# Altium project 6s电池均衡.PrjPcb
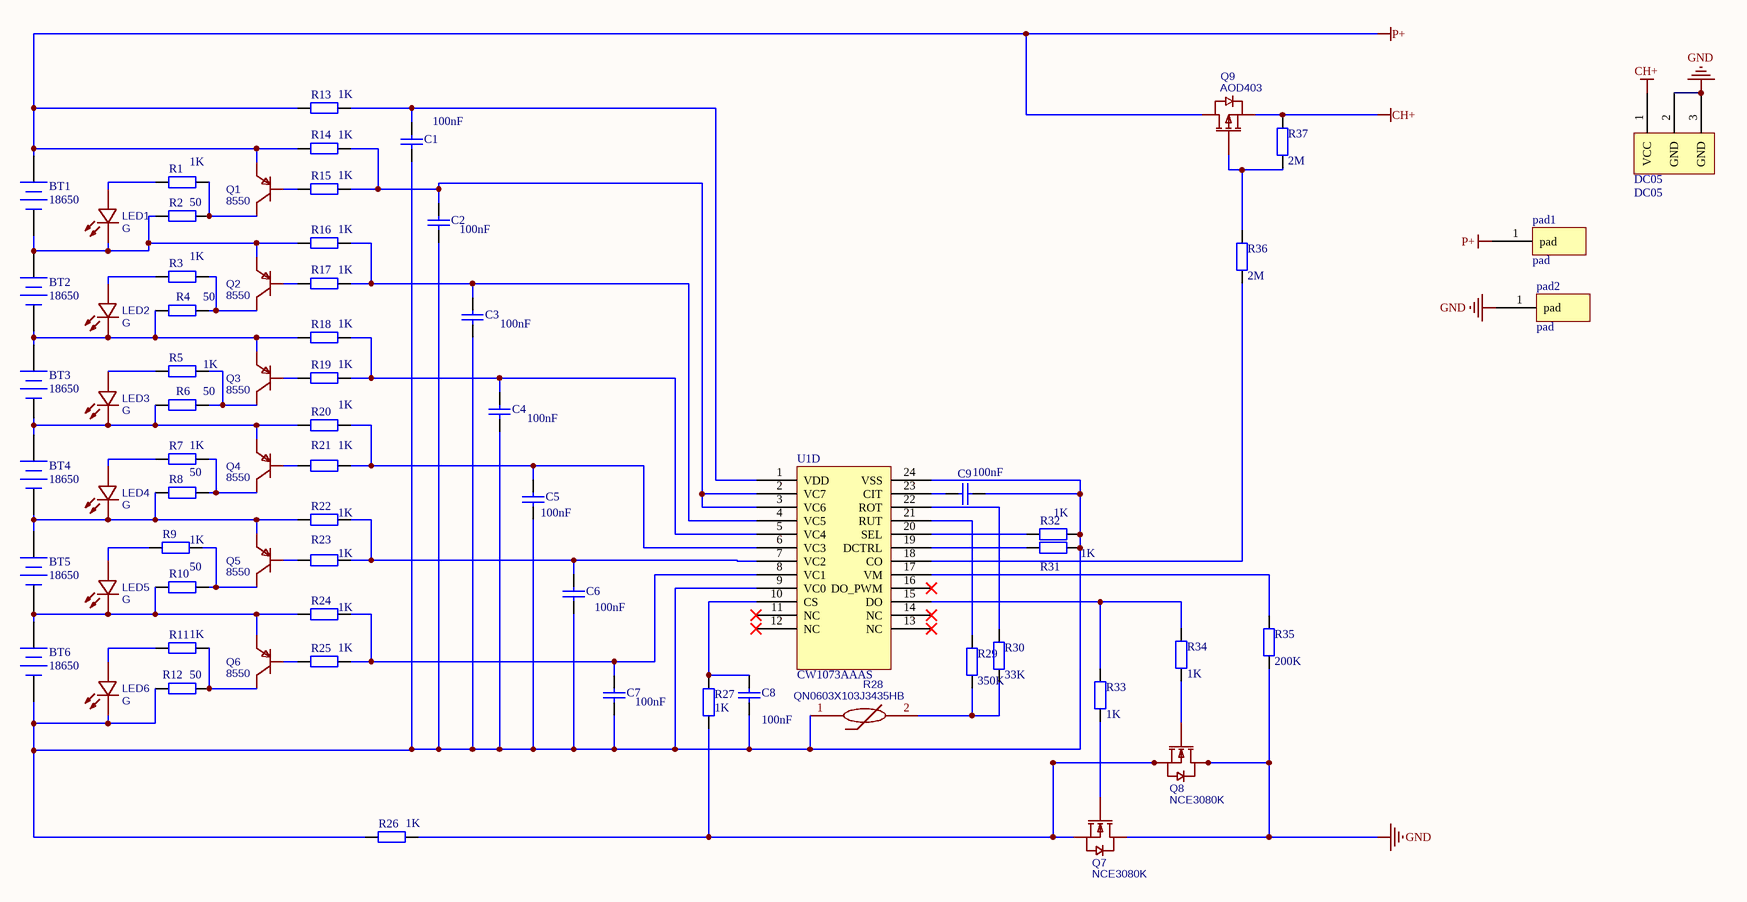
[diagram p0: Sheet1.SchDoc]
1 sheet, 71 parts. Net scope: global (net labels, ports and power ports of the same name join across sheets).
Board file: PCB3.PcbDoc

## Sheet Sheet1.SchDoc
size A3

### Parts
BT1  18650  [18650-贴片]
BT2  18650  [18650-贴片]
BT3  18650  [18650-贴片]
BT4  18650  [18650-贴片]
BT5  18650  [18650-贴片]
BT6  18650  [18650-贴片]
C1  value 100nF  [0805_C]
C2  value 100nF  [0805_C]
C3  value 100nF  [0805_C]
C4  value 100nF  [0805_C]
C5  value 100nF  [0805_C]
C6  value 100nF  [0805_C]
C7  value 100nF  [0805_C]
C8  value 100nF  [0805_C]
C9  value 100nF  [0805_C]
DC05  DC05  [DC-005 - duplicate]
LED1  G  [LED_0805]
LED2  G  [LED_0805]
LED3  G  [LED_0805]
LED4  G  [LED_0805]
LED5  G  [LED_0805]
LED6  G  [LED_0805]
pad1  pad  [PAD3*3]
pad2  pad  [PAD3*3]
Q1  8550  [SOT23]
Q2  8550  [SOT23]
Q3  8550  [SOT23]
Q4  8550  [SOT23]
Q5  8550  [SOT23]
Q6  8550  [SOT23]
Q7  NCE3080K  [LC-TO-252-2]
Q8  NCE3080K  [LC-TO-252-2]
Q9  AOD403  [LC-TO-252-2]
R1  value 1K  [0603-R]
R2  value 50  [LC-2512_R]
R3  value 1K  [0603-R]
R4  value 50  [LC-2512_R]
R5  value 1K  [0603-R]
R6  value 50  [LC-2512_R]
R7  value 1K  [0603-R]
R8  value 50  [LC-2512_R]
R9  value 1K  [0603-R]
R10  value 50  [LC-2512_R]
R11  value 1K  [0603-R]
R12  value 50  [LC-2512_R]
R13  value 1K  [0603-R]
R14  value 1K  [0603-R]
R15  value 1K  [0603-R]
R16  value 1K  [0603-R]
R17  value 1K  [0603-R]
R18  value 1K  [0603-R]
R19  value 1K  [0603-R]
R20  value 1K  [0603-R]
R21  value 1K  [0603-R]
R22  value 1K  [0603-R]
R23  value 1K  [0603-R]
R24  value 1K  [0603-R]
R25  value 1K  [0603-R]
R26  value 1K  [0603-R]
R27  value 1K  [0603-R]
R28  QN0603X103J3435HB  [0603-R]
R29  value 350K  [0603-R]
R30  value 33K  [0603-R]
R31  value 1K  [0603-R]
R32  value 1K  [0603-R]
R33  value 1K  [0603-R]
R34  value 1K  [0603-R]
R35  value 200K  [0603-R]
R36  value 2M  [0603-R]
R37  value 2M  [0603-R]
U1  CW1073AAAS  [LC-SSOP-24_208mil]  (part D of 4)

### Nets
CH+: DC05.1(VCC) Q9.3(S) R37.2
GND: DC05.2(GND) DC05.3(GND) pad2.1(pad) Q7.2(D) Q8.2(D) R35.1
P+: BT1.1(+) pad1.1(pad) Q1.2(E) Q9.2(D) R13.1 R14.1
NetBT1_2: BT1.2(-) BT2.1(+) LED1.2(K) Q2.2(E) R2.1 R16.1
NetBT2_2: BT2.2(-) BT3.1(+) LED2.2(K) Q3.2(E) R4.1 R18.1
NetBT3_2: BT3.2(-) BT4.1(+) LED3.2(K) Q4.2(E) R6.1 R20.1
NetBT4_2: BT4.2(-) BT5.1(+) LED4.2(K) Q5.2(E) R8.1 R22.1
NetBT5_2: BT5.2(-) BT6.1(+) LED5.2(K) Q6.2(E) R10.1 R24.1
NetBT6_2: BT6.2(-) C1.2 C2.2 C3.2 C4.2 C5.2 C6.2 C7.2 C8.2 C9.1 LED6.2(K) R12.1 R26.1 R28.1 R31.2 R32.2 U1.9(VC0) U1.24(VSS)
NetC1_1: C1.1 R13.2 U1.1(VDD)
NetC2_1: C2.1 R14.2 R15.2 U1.2(VC7) U1.3(VC6)
NetC3_1: C3.1 R16.2 R17.2 U1.4(VC5)
NetC4_1: C4.1 R18.2 R19.2 U1.5(VC4)
NetC5_1: C5.1 R20.2 R21.2 U1.6(VC3)
NetC6_1: C6.1 R22.2 R23.2 U1.7(VC2)
NetC7_1: C7.1 R24.2 R25.2 U1.8(VC1)
NetC8_1: C8.1 R27.2 U1.10(CS)
NetC9_2: C9.2 U1.23(CIT)
NetLED1_1: LED1.1(A) R1.1
NetLED2_1: LED2.1(A) R3.1
NetLED3_1: LED3.1(A) R5.1
NetLED4_1: LED4.1(A) R7.1
NetLED5_1: LED5.1(A) R9.1
NetLED6_1: LED6.1(A) R11.1
NetQ1_1: Q1.1(B) R15.1
NetQ1_3: Q1.3(C) R1.2 R2.2
NetQ2_1: Q2.1(B) R17.1
NetQ2_3: Q2.3(C) R3.2 R4.2
NetQ3_1: Q3.1(B) R19.1
NetQ3_3: Q3.3(C) R5.2 R6.2
NetQ4_1: Q4.1(B) R21.1
NetQ4_3: Q4.3(C) R7.2 R8.2
NetQ5_1: Q5.1(B) R23.1
NetQ5_3: Q5.3(C) R9.2 R10.2
NetQ6_1: Q6.1(B) R25.1
NetQ6_3: Q6.3(C) R11.2 R12.2
NetQ7_1: Q7.1(G) R33.1
NetQ7_3: Q7.3(S) Q8.3(S) R26.2 R27.1
NetQ8_1: Q8.1(G) R34.1
NetQ9_1: Q9.1(G) R36.2 R37.1
NetR28_2: R28.2 R29.1 R30.1
NetR29_2: R29.2 U1.21(RUT)
NetR30_2: R30.2 U1.22(ROT)
NetR31_1: R31.1 U1.19(DCTRL)
NetR32_1: R32.1 U1.20(SEL)
NetR33_2: R33.2 R34.2 U1.15(DO)
NetR35_2: R35.2 U1.17(VM)
NetR36_1: R36.1 U1.18(CO)

Not connected (* = marked no-connect by the designer): U1 11(NC)* 12(NC)* 13(NC)* 14(NC)* 16(DO_PWM)*

### Library data of the parts
BT1-BT6 = Battery: Multicell Battery; Published: 24-Mar-1999; LatestRevisionDate: 17-Jul-2002; LatestRevisionNote: Re-released for DXP Platform.; PackageReference: BAT-2; Publisher: Altium Limited; PackageDescription: Battery; 2 Leads
C1-C9 = Cap: Capacitor; Published: 8-Jun-2000; LatestRevisionDate: 17-Jul-2002; LatestRevisionNote: Re-released for DXP Platform.; PackageReference: RAD-0.3; Publisher: Altium Limited; PackageDescription: Radial Cap, Thru-Hole; 2 Leads; 0.3 in Pin Spacing
DC05 = DC05: DC05电源
LED1-LED6 = G: BOM_Manufacturer: Everlight Elec; BOM_Manufacturer Part: 19-21CUTD/S3484/TR8; Contributor: LCSC; BOM_Supplier: LCSC; BOM_Supplier Part: C264445; spicePre: L; spiceSymbolName: 19-21CUTD/S3484/TR8
pad1 pad2 = pad1
Q1-Q6 = 8550: BOM_Manufacturer: Foshan Blue Rocket Elec; BOM_Manufacturer Part: S8550M-D; Contributor: LCSC; BOM_Supplier: LCSC; BOM_Supplier Part: C305484; spicePre: Q; spiceSymbolName: S8550M-D
Q7 Q8 = NCE3080K: BOM_Manufacturer: Ncepower; SMT Type: Extend; BOM_Supplier: LCSC; BOM_Manufacturer Part: NCE3080K; BOM_Supplier Part: C108901; BOM_JLCPCB SMD: Yes; spicePre: Q; spiceSymbolName: NCE3080K
Q9 = AOD403: BOM_Manufacturer: AOS; SMT Type: Extend; BOM_Supplier: LCSC; BOM_Manufacturer Part: AOD403; image: //image.lceda.cn/szlcsc/C28969.jpg; BOM_Supplier Part: C28969; BOM_JLCPCB SMD: Yes; spicePre: Q; spiceSymbolName: AOD403
R1-R27 R29-R37 = Res2: Resistor; Published: 8-Jun-2000; LatestRevisionDate: 17-Jul-2002; LatestRevisionNote: Re-released for DXP Platform.; PackageReference: AXIAL-0.4; Publisher: Altium Limited; PackageDescription: Axial Device, Thru-Hole; 2 Leads; 0.4 in Pin Spacing
R28 = QN0603X103J3435HB: BOM_Manufacturer: QAMcn; Contributor: LCSC; BOM_Supplier: LCSC; BOM_Supplier Part: C700828; BOM_Manufacturer Part: QN0603X103J3435HB; spicePre: R; spiceSymbolName: QN0603X103J3435HB
U1 = Component_1